# EAGLE schematic basic_attiny84 (EAGLE 9.6.2)
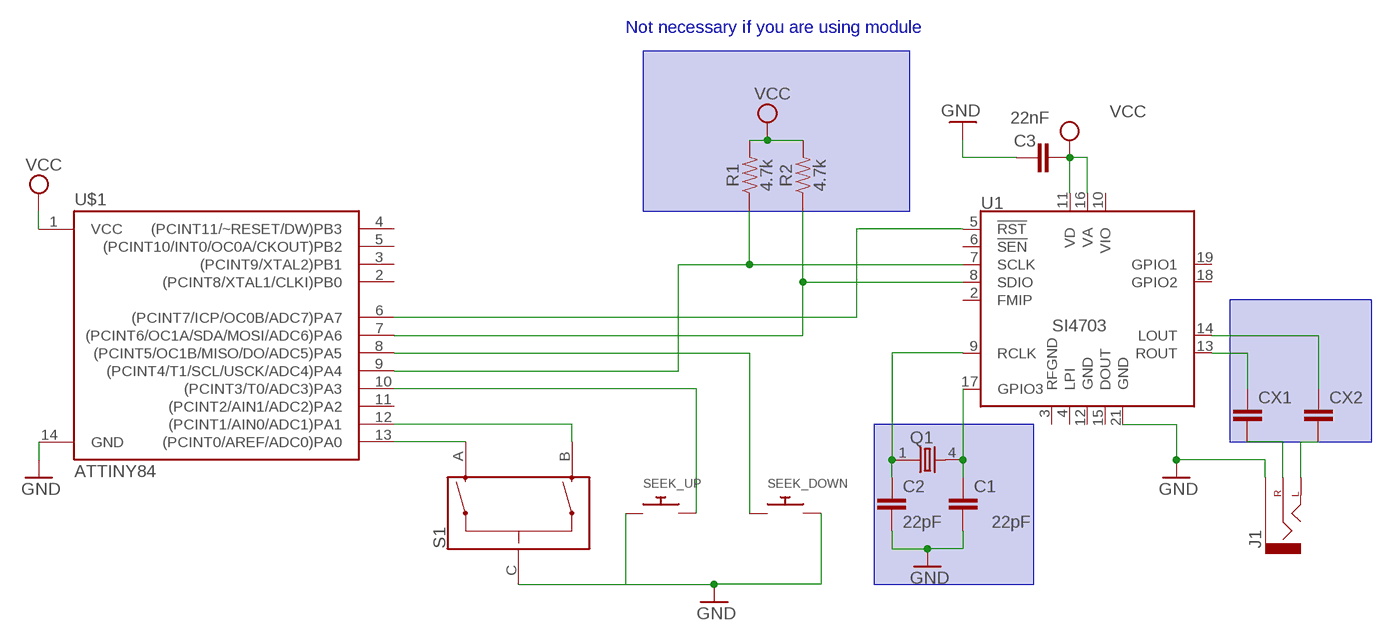
[diagram p0: schematic, sheet 1]

## Parts
C1  22pF  C2,5-3  [C2.5-3]
C2  22pF  C2,5-3  [C2.5-3]
C3  22nF  C2,5-3  [C2.5-3]
CX1  CXXC10B6  [XC10B6]
CX2  CXXC10B6  [XC10B6]
J1  AUDIO_JACK_2.5MM_HOLESONLY  [STEREOJACK2.5MM_SPECIAL_HOLES-ONLY]
Q1  86SMX  [86SMX]
R1  4.7k  4.7KOHM-0603-1/10W-1%  [0603]
R2  4.7k  4.7KOHM-0603-1/10W-1%  [0603]
S1  ENCODER  [ENCODER-16MM-QUAD]
SEEK_DOWN  SWITCH_PUSHBUTTONC&K_KSS  [BTN_CK_KSS]
SEEK_UP  SWITCH_PUSHBUTTONC&K_KSS  [BTN_CK_KSS]
U1  SI4703  [QFN-20-3X3MM]
U$1  ATTINY84  [SO14]

## Nets
GND: C1.2 C2.2 C3.1 J1.RING1(SLEEVE) S1.C SEEK_DOWN.P$2 SEEK_UP.P$1 U1.21(GND) U$1.14(GND)
N$1: R1.1 U1.7(SCLK) U$1.9((PCINT4/T1/SCL/USCK/ADC4)PA4)
N$2: R2.1 U1.8(SDIO) U$1.7((PCINT6/OC1A/SDA/MOSI/ADC6)PA6)
N$3: U1.5(!RST) U$1.6((PCINT7/ICP/OC0B/ADC7)PA7)
N$4: C1.1 Q1.4 U1.17(GPIO3)
N$5: C2.1 Q1.1 U1.9(RCLK)
N$6: SEEK_UP.P$2 U$1.10((PCINT3/T0/ADC3)PA3)
N$7: S1.A U$1.13((PCINT0/AREF/ADC0)PA0)
N$8: SEEK_DOWN.P$1 U$1.8((PCINT5/OC1B/MISO/DO/ADC5)PA5)
N$9: S1.B U$1.12((PCINT1/AIN0/ADC1)PA1)
N$16: CX1.1 U1.13(ROUT)
N$19: CX2.1 U1.14(LOUT)
N$20: CX1.2 J1.TIP(RIGHT)
N$21: CX2.2 J1.SHIELD(LEFT)
VCC: C3.2 R1.2 R2.2 U1.11(VD) U1.16(VA) U$1.1(VCC)
Unconnected: U1.2(FMIP) U1.3(RFGND) U1.4(LPI) U1.6(!SEN) U1.10(VIO) U1.12(GND) U1.15(DOUT) U1.18(GPIO2) U1.19(GPIO1) U$1.2((PCINT8/XTAL1/CLKI)PB0) U$1.3((PCINT9/XTAL2)PB1) U$1.4((PCINT11/~RESET/DW)PB3) U$1.5((PCINT10/INT0/OC0A/CKOUT)PB2) U$1.11((PCINT2/AIN1/ADC2)PA2)

## Notes on the sheet
- Not necessary if you are using module

## Library data of the parts
C1-C3 = capacitor-wima:C: CAPACITOR naming: grid - package width
CX1 CX2 = rcl:CX: X CAPACITOR for power line; SPICEPREFIX: C
J1 = SparkFun-Connectors:AUDIO_JACK_2.5MM: Audio Jack 2.5mm variants of PTH and SMT audio jacks. SparkFun Products: SparkFun PicoBoard <https://www.sparkfun.com/products/11888>- 2.5mm SMD
Q1 = crystal:86SMX: CRYSTAL; MF: C-MAC FREQUENCY PRODUCTS LTD; MPN: XTAL003321- 86SMX; OC_FARNELL: 6344914; OC_NEWARK: 01H9866
R1 R2 = SparkFun-Resistors:4.7KOHM: 4.7kΩ resistor A resistor is a passive two-terminal electrical component that implements electrical resistance as a circuit element. Resistors act to reduce current flow, and, at the same time, act to lower voltage levels within circuits. - Wikipedia; PROD_ID: RES-07857
S1 = SparkFun-Switches:ENCODER: Rotary Encoder Encoders rotate similarly to potentiometers, but they’re different from potentiometers in that an encoder has full rotation without limits. They output gray code so that you can tell how much and in which direction the encoder has been turned. SparkFun Products Used on the https://www.sparkfun.com/products/11043 (COM-11043); PROD_ID: RES-11299
SEEK_DOWN SEEK_UP = adafruit:SWITCH_PUSHBUTTON: Buttons SOFTTOUCHSMD_SJ - Soft touch temporary push button (Super Junk Akihabara) Compatible with SKPMANE010 [Mouser: 688-SKPMAN] C&K_KSS = Digikey: KSS221GLFS
U1 = SI4703:SI4703: Silicon Labs Si4703 FM Tuner Beyond enabling you to tune in to FM radio stations, the Si4703 is also capable of detecting and processing both Radio Data Service (RDS) and Radio Broadcast Data Service (RBDS) information. The Si4703 even does a very good job of filtering and carrier detection. It also enables data such as the station ID and song name to be displayed to the user. SparkFun Products SparkFun FM Tuner Evaluation Board - Si4703 <https://www.sparkfun.com/products/12938> (WRL-12938) SparkFun FM Tuner Basic Breakout - Si4703 <https://www.sparkfun.com/products/11083> (WRL-11083) FabFM Radio Kit <https://www.sparkfun.com/products/11043> (KIT-11043); AVAILABILITY: Unavailable; DESCRIPTION: - Tuner For Use With Si4703; MF: SparkFun Electronics; MP: SI4703; PACKAGE: UFQFN-20 SparkFun Electronics; PRICE: None
U$1 = SparkFun-IC-Microcontroller:ATTINY84: Atmel 14-pin 2/4/8kB flash uC Datasheet <https://cdn.sparkfun.com/datasheets/Widgets/doc8006.pdf> SparkFun Products Tiny AVR Programmer <https://www.sparkfun.com/products/11801> (PGM-11801) SparkFun Servo Trigger - Continuous Rotation <https://www.sparkfun.com/products/13872> (WIG-13872) SparkFun Servo Trigger <https://www.sparkfun.com/products/13118> (WIG-13118); PROD_ID: IC-11285